# EAGLE design Bit Wah 2 (EAGLE 9.6.2)
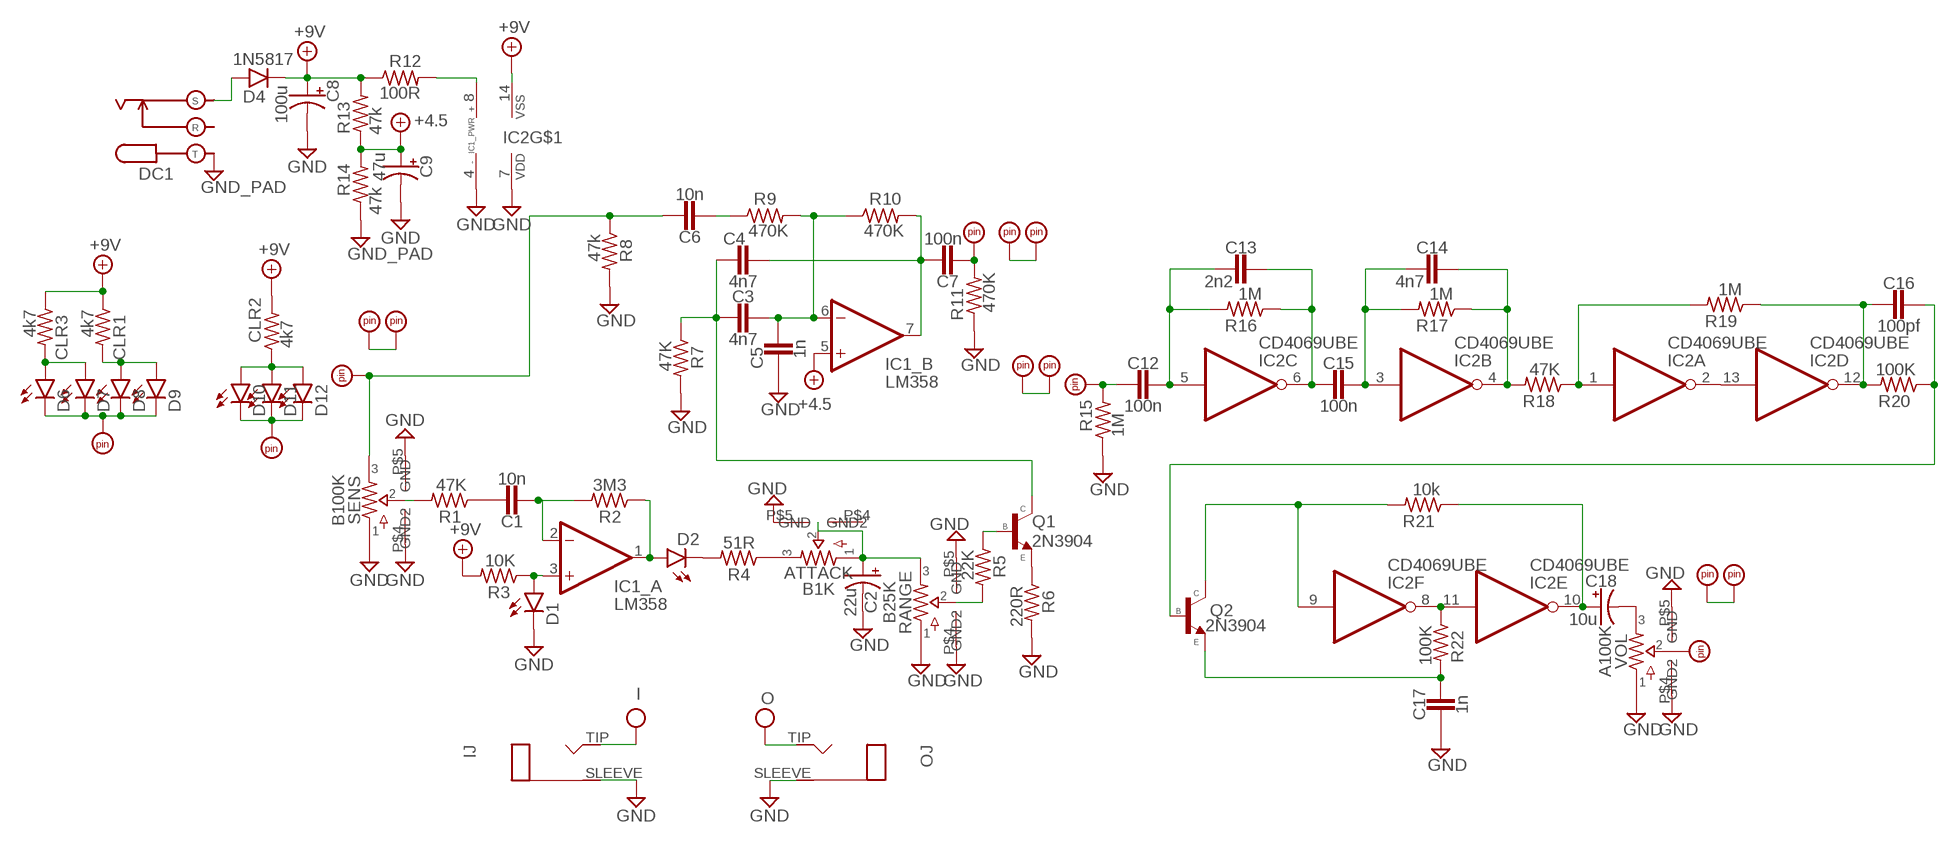
[diagram p0: schematic, sheet 1]

## Parts
1O  PADS.SQR_NL  [PAD4]
ATTACK  B1K  9MM.1  [9MM_METAL_SHAFT]
C1  10n  CAP  [0.2".SML.MED]
C2  22u  5MM.2  [0502]
C3  4n7  CAP  [0.2".SML.MED]
C4  4n7  CAP  [0.2".SML.MED]
C5  1n  CAP  [0.2".SML.MED]
C6  10n  CAP  [0.2".SML.MED]
C7  100n  CAP  [0.2".SML.MED]
C8  100u  6MM.2  [0632]
C9  47u  5MM.2  [0502]
C12  100n  CAP  [0.2".SML.MED]
C13  2n2  CAP  [0.2".SML.MED]
C14  4n7  CAP  [0.2".SML.MED]
C15  100n  CAP  [0.2".SML.MED]
C16  100pf  CAP.2  [0.2".SML]
C17  1n  CAP  [0.2".SML.MED]
C18  10u  5MM.2  [0502]
CLR1  4k7  RESISTORS.3B  [R0207/3]
CLR2  4k7  RESISTORS.3B  [R0207/3]
CLR3  4k7  RESISTORS.3B  [R0207/3]
D1  3MM RED  LED3MM  [LED3MM]
D2  3MM RED  LED3MM  [LED3MM]
D4  1N5817  DO41.3  [DO41-3]
D6  LED3MM  [LED3MM]
D7  LED3MM  [LED3MM]
D8  LED3MM  [LED3MM]
D9  LED3MM  [LED3MM]
D10  LED3MM  [LED3MM]
D11  LED3MM  [LED3MM]
D12  LED3MM  [LED3MM]
DC1  DC  DC_KOBICONN  [DC_KOBICONN]
GND2  GND_PAD  [SQUARE]
GND5  GND_PAD  [SQUARE]
I  IN  [SQUARE]
IC1  LM358  DUAL_TH  [DIP08]
IC2  CD4069UBE  [DIL14]
IJ  MONOPADS  [TWO_PADS]
O  OUT  [SQUARE]
OJ  MONOPADS  [TWO_PADS]
Q1  2N3904  NPN.2  [INLINE]
Q2  2N3904  NPN.2  [INLINE]
R1  47K  RESISTORS.3B  [R0207/3]
R2  3M3  RESISTORS.3B  [R0207/3]
R3  10K  RESISTORS.3B  [R0207/3]
R4  51R  RESISTORS.3B  [R0207/3]
R5  22K  RESISTORS.3B  [R0207/3]
R6  220R  RESISTORS.3B  [R0207/3]
R7  47K  RESISTORS.3B  [R0207/3]
R8  47k  RESISTORS.3B  [R0207/3]
R9  470K  RESISTORS.3B  [R0207/3]
R10  470K  RESISTORS.3B  [R0207/3]
R11  470K  RESISTORS.3B  [R0207/3]
R12  100R  RESISTORS.3B  [R0207/3]
R13  47k  RESISTORS.3B  [R0207/3]
R14  47k  RESISTORS.3B  [R0207/3]
R15  1M  RESISTORS.3B  [R0207/3]
R16  1M  RESISTORS.3B  [R0207/3]
R17  1M  RESISTORS.3B  [R0207/3]
R18  47K  RESISTORS.3B  [R0207/3]
R19  1M  RESISTORS.3B  [R0207/3]
R20  100K  RESISTORS.3B  [R0207/3]
R21  10k  RESISTORS.3B  [R0207/3]
R22  100K  RESISTORS.3B  [R0207/3]
RA  PADS.SQR_NL  [PAD4]
RANGE  B25K  9MM.1  [9MM_METAL_SHAFT]
RB  PADS.SQR_NL  [PAD4]
RB1  PADS.SQR_NL  [PAD4]
SA  PADS.SQR_NL  [PAD4]
SA1  PADS.SQR_NL  [PAD4]
SB  PADS.SQR_NL  [PAD4]
SB1  PADS.SQR_NL  [PAD4]
SENS  B100K  9MM.1  [9MM_METAL_SHAFT]
SW1  SW1  PADS.SQR_NL  [PAD4]
SW2  PADS.SQR_NL  [PAD4]
U$4  OUT1  PADS.SQR_NL  [PAD4]
U$5  PADS.SQR_NL  [PAD4]
U$6  PADS.SQR_NL  [PAD4]
U$7  PADS.SQR_NL  [PAD4]
VOL  A100K  9MM.1  [9MM_METAL_SHAFT]

## Nets
+9V: C8.+ CLR1.1 CLR2.2 CLR3.1 D4.C IC2.14(VSS) R3.2 R12.1 R13.2
GND: ATTACK.P$5(GND2) C2.- C5.2 C8.- C9.- C17.2 D1.K(C) DC1.T GND2.1(GND) GND5.1(GND) IC1.4(_PWR:V-) IC2.7(VDD) IJ.SLEEVE OJ.SLEEVE R6.2 R7.2 R8.2 R11.1 R14.1 R15.1 RANGE.P$1 RANGE.P$4(GND) RANGE.P$5(GND2) SENS.P$1 SENS.P$4(GND) SENS.P$5(GND2) VOL.P$1 VOL.P$4(GND) VOL.P$5(GND2)
IN: I.1(IN) IJ.TIP
N$1: C1.1 R1.1
N$2: 1O.P$1 RA.P$1
N$3: D1.A IC1.3(_A:+IN) R3.1
N$4: D4.A DC1.S
N$5: ATTACK.P$1 ATTACK.P$2 C2.+ RANGE.P$3
N$6: SA1.P$1 SA.P$1
N$7: R1.2 SENS.P$2
N$8: C1.2 IC1.2(_A:-IN) R2.2
N$9: D2.A IC1.1(_A:OUT) R2.1
N$10: D2.K(C) R4.2
N$11: ATTACK.P$3 R4.1
N$12: IC1.8(_PWR:V+) R12.2
N$13: Q1.1(E) R6.1
N$14: R5.2 RANGE.P$2
N$15: Q1.2(B) R5.1
N$16: C3.2 C4.2 Q1.3(C) R7.1
N$17: C3.1 C5.1 IC1.6(_B:-IN) R9.2 R10.1
N$18: C6.2 R9.1
N$19: C12.1 C13.2 IC2.5(C:I) R16.2
N$20: C4.1 C7.1 IC1.7(_B:OUT) R10.2
N$21: C13.1 C15.2 IC2.6(C:O) R16.1
N$22: C14.2 C15.1 IC2.3(B:I) R17.2
N$23: C14.1 IC2.4(B:O) R17.1 R18.2
N$24: IC2.1(A:I) R18.1 R19.2
N$25: IC2.2(A:O) IC2.13(D:I)
N$26: C16.2 IC2.12(D:O) R19.1 R20.2
N$27: C16.1 Q2.2(B) R20.1
N$28: IC2.8(F:O) IC2.11(E:I) R22.1
N$29: C17.1 Q2.1(E) R22.2
N$30: C18.+ IC2.10(E:O) R21.1
N$31: C18.- VOL.P$3
N$32: IC2.9(F:I) Q2.3(C) R21.2
N$33: D6.K(C) D7.K(C) D8.K(C) D9.K(C) SW1.P$1
N$34: D10.K(C) D11.K(C) D12.K(C) SW2.P$1
N$35: CLR1.2 D8.A D9.A
N$36: CLR2.1 D10.A D11.A D12.A
N$37: SB1.P$1 SB.P$1
N$38: RB1.P$1 RB.P$1
N$39: C7.2 R11.2 U$4.P$1
N$40: C6.1 R8.1 SENS.P$3 U$5.P$1
N$41: C12.2 R15.2 U$6.P$1
N$42: U$7.P$1 VOL.P$2
N$43: CLR3.2 D6.A D7.A
OUT: O.1(OUT) OJ.TIP
VA: C9.+ IC1.5(_B:+IN) R13.1 R14.2 ; supply symbol labelled +4.5
Unconnected: ATTACK.P$4(GND) DC1.R

## Library data of the parts
1O RA RB RB1 SA SA1 SB SB1 SW1 SW2 U$4-U$7 = supply pins:PADS.: Pads For I/O connections or test point pads on PCBs.
ATTACK RANGE SENS VOL = potentiometers:9MM: 9mm Potentiometers
C1 C3-C7 C12-C17 = caps-film:CAP: For Ceramic, Film, MLCC caps
C2 C9 C18 = caps-elec:5MM: 5mm diameter caps Up to 47uF
C8 = caps-elec:6MM: 6.3mm diameter caps 100uF - 270uF
CLR1-CLR3 R1-R22 = resistors:RESISTORS
D1 D2 D6-D12 = diodes:LED
D4 = diodes:DO41: 1N400x, 1N5817 Standard and Schottky Rectifiers, DO-41 Package 1N4001: http://smallbear-electronics.mybigcommerce.com/diode-1n4001/ 1N5817: http://www.mouser.com/ProductDetail/Fairchild-Semiconductor/1N5817/?qs=sGAEpiMZZMtQ8nqTKtFS%2fCJFZUIIOyzjWJhH2RQmKoY%3d
DC1 = jacks:DC_KOBICONN
GND2 GND5 = supply pins:GND_PAD: Ground use this to hook up ground connections throughout a schematic instead of running wire automatically labels the net "GND"
I = supply pins:IN: Input obsolete: use Mark instead and label net schematic input label without circuit board terminal/pad labels net "IN" provided as complement to OUT (rarely used)
IC1 = integrated circuits:DUAL: Generic Dual OP-AMP
IC2 = CD4069UBE Pin:CD4069UBE: Hex Inverting Buffer
IJ OJ = jacks:MONO: Mono 1/4" Phone Jack
O = supply pins:OUT: Output obsolete: use Mark instead and label net output label without circuit board terminal/pad commonly used as output label on 2nd lug of a potentiometer
Q1 Q2 = transistors-GERM:NPN: NPN Germanium (E)-B-C pinout TO-5 socket: http://smallbear-electronics.mybigcommerce.com/to-5-transistor-mill-max/

## Board
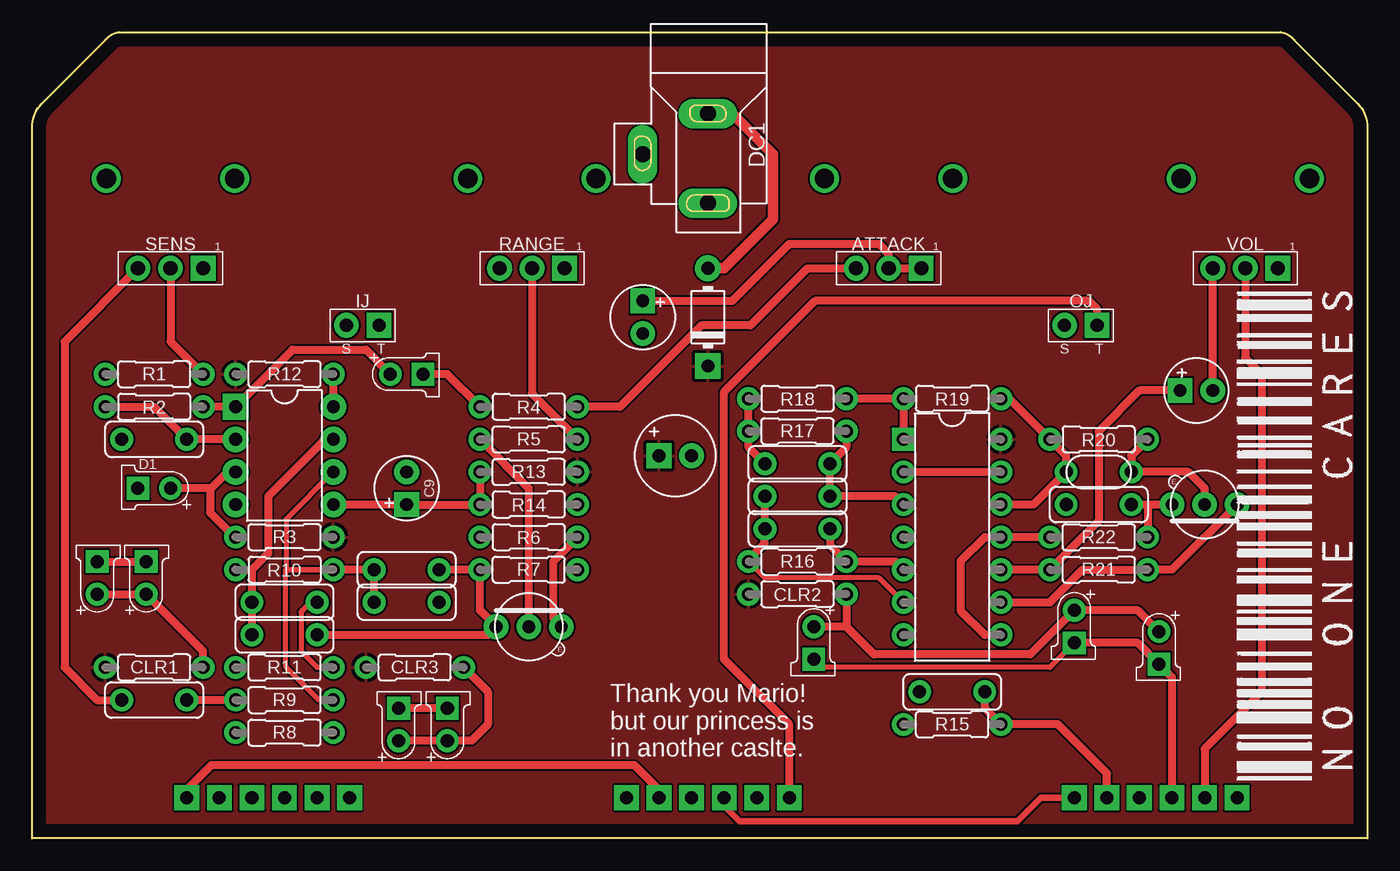
[diagram p1: board, top side]
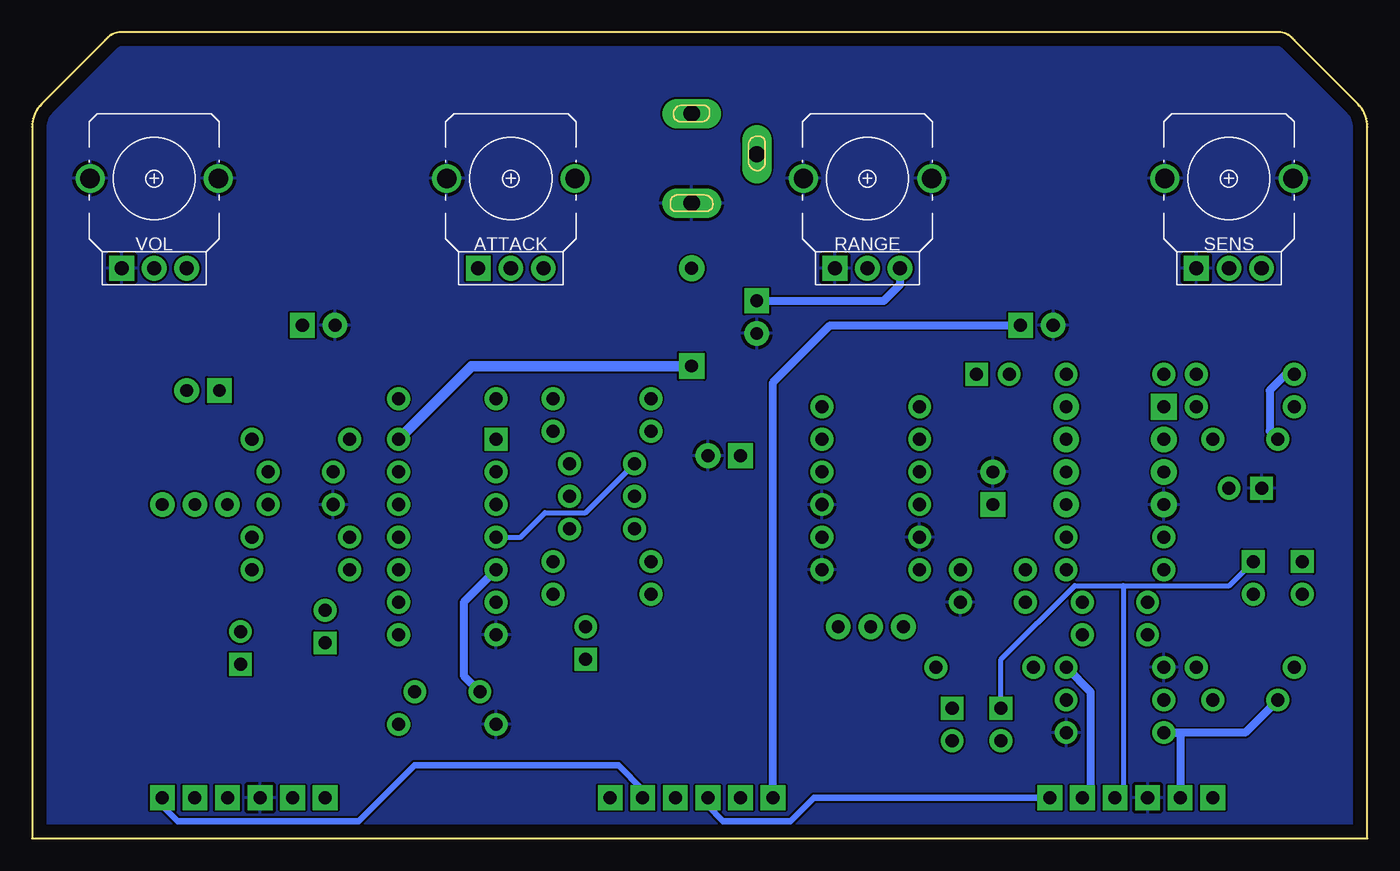
[diagram p2: board, bottom side, seen from below]

Size 104.14 x 62.87 mm. Coordinates in mm from the lower left corner, seen from the top.
Outline: 0,0 0,55.46 arc-45 0.74,57.26 5.61,62.12 arc-45 6.77,62.87 97.37,62.87 arc-45 98.53,62.12 103.4,57.26 arc-45 104.14,55.46 104.14,0 0,0
Copper layers (1*16): Top 0.035mm / dielectric 1.5mm / Bottom 0.035mm
Design rules "default": minimum track width 6mil, minimum drill 0.35mm, track to track 6mil, track to pad 6mil, pad to pad 6mil, via to via 6mil, smd to smd 6mil, copper to edge 40mil, drill to drill 6mil, minimum pad ring 10mil, minimum via ring 8mil, stop-mask expansion 4mil, vias tented up to drill 0mil, thermal gap 10mil

### Footprints (pad centres in the part's own frame; a part is rotated, then mirrored left to right if it is on the bottom)
PAD4 = drill 1.016 pad 1.93 square: P$1 0,0
9MM_METAL_SHAFT = drill 1.1 pad 1.93 square: P$1 2.54,0 | drill 1.1 pad 1.93: P$2 0,0; P$3 -2.54,0 | drill 1.5: P$4 -5,7; P$5 5,7
0.2".SML.MED = drill 1.016 pad 1.778: 1 -2.54,0; 2 2.54,0
0502 = drill 1 pad 1.93 square: + -1.27,0 | drill 1 pad 1.93: - 1.27,0
0632 = drill 1 pad 1.93 square: + -1.27,0 | drill 1 pad 1.93: - 1.27,0
0.2".SML = drill 1.016 pad 1.778: 1 -2.54,0; 2 2.54,0
R0207/3 = drill 1.016 pad 1.778: 1 -3.81,0; 2 3.81,0
LED3MM = drill 1.016 pad 1.778: A -1.27,0 | drill 1.016 pad 1.778 square: K 1.27,0
DO41-3 = drill 1 pad 2: A 3.81,0 | drill 1 pad 2 square: C -3.81,0
DC_KOBICONN = drill 1.27 pad 2.286 long: R 0,5.08; S 3.175,0; T -3.81,0
SQUARE = drill 1.016 pad 1.93 square: 1 0,0
DIP08 = drill 1 pad 2 square: 1 -3.81,-3.81 | drill 1 pad 2: 2 -1.27,-3.81; 3 1.27,-3.81; 4 3.81,-3.81; 5 3.81,3.81; 6 1.27,3.81; 7 -1.27,3.81; 8 -3.81,3.81
DIL14 = drill 1.016 pad 1.778 square: 1 -7.62,-3.81 | drill 1.016 pad 1.778: 2 -5.08,-3.81; 3 -2.54,-3.81; 4 0,-3.81; 5 2.54,-3.81; 6 5.08,-3.81; 7 7.62,-3.81; 8 7.62,3.81; 9 5.08,3.81; 10 2.54,3.81; 11 0,3.81; 12 -2.54,3.81; 13 -5.08,3.81; 14 -7.62,3.81
TWO_PADS = drill 1.016 pad 1.93: SLEEVE -1.27,0 | drill 1.016 pad 1.93 square: TIP 1.27,0
INLINE = drill 1 pad 1.93: 1 -2.54,0; 2 0,0; 3 2.54,0

### Placement (x,y rotation side)
1O  51.44,3.17 0 top
ATTACK  66.8,44.45 0 top
C1  9.53,31.11 0 top
C2  47.62,40.64 270 top
C3  29.21,20.95 0 top
C4  19.68,15.88 0 top
C5  29.21,18.41 0 top
C6  9.53,10.79 0 top
C7  19.68,18.41 0 top
C8  50.16,29.84 0 top
C9  29.21,27.3 90 top
C12  71.75,11.43 0 top
C13  59.69,24.13 0 top
C14  59.69,29.21 0 top
C15  59.69,26.67 180 top
C16  83.19,28.57 180 top
C17  83.19,26.04 180 top
C18  90.8,34.92 0 top
CLR1  9.53,13.34 0 top
CLR2  59.69,19.05 180 top
CLR3  29.84,13.34 0 top
D1  9.53,27.3 180 top
D2  29.21,36.2 0 top
D4  52.7,40.64 90 top
D6  32.38,8.89 90 top
D7  28.57,8.89 90 top
D8  8.89,20.32 90 top
D9  5.08,20.32 90 top
D10  60.96,15.24 270 top
D11  81.28,16.51 270 top
D12  87.88,14.86 270 top
DC1  52.7,53.34 90 top
GND2  86.36,3.17 0 top
GND5  17.14,3.17 0 top
I  46.35,3.17 0 top
IC1  19.68,29.84 270 top
IC2  71.75,23.5 270 top
IJ  25.78,40.01 0 top
O  59.05,3.17 0 top
OJ  81.79,40.01 0 top
Q1  38.73,16.51 180 top
Q2  91.44,26.04 0 top
R1  9.53,36.2 0 top
R2  9.53,33.66 180 top
R3  19.68,23.5 0 top
R4  38.73,33.66 180 top
R5  38.73,31.11 0 top
R6  38.73,23.5 180 top
R7  38.73,20.95 0 top
R8  19.68,8.26 0 top
R9  19.68,10.79 0 top
R10  19.68,20.95 180 top
R11  19.68,13.34 0 top
R12  19.68,36.2 0 top
R13  38.73,28.57 0 top
R14  38.73,26.04 180 top
R15  71.75,8.89 0 top
R16  59.69,21.59 0 top
R17  59.69,31.75 0 top
R18  59.69,34.29 180 top
R19  71.75,34.29 180 top
R20  83.19,31.11 180 top
R21  83.19,20.95 0 top
R22  83.19,23.5 0 top
RA  24.77,3.17 0 top
RANGE  38.99,44.45 0 top
RB  93.98,3.17 0 top
RB1  56.52,3.17 0 top
SA  12.07,3.17 0 top
SA1  48.89,3.17 0 top
SB  81.28,3.17 0 top
SB1  53.98,3.17 0 top
SENS  10.79,44.45 0 top
SW1  19.68,3.17 0 top
SW2  88.9,3.17 0 top
U$4  22.22,3.17 0 top
U$5  14.61,3.17 0 top
U$6  83.82,3.17 0 top
U$7  91.44,3.17 0 top
VOL  94.61,44.45 0 top

### Tracks (layer width: path | path; a pad name or v marks a point on that pad's centre or on a via)
+9V
  Bottom 0.813: D4.C 69.85,36.83 IC2.14
  pour Top: 0.11,0 0.11,56.62 5.61,62.12 arc-45 7.4,62.87 96.74,62.87 arc-45 98.53,62.12 103.4,57.26 arc-45 104.14,55.46 104.14,0
GND
  pour Bottom: 0.11,0 0.11,56.62 5.61,62.12 arc-45 7.4,62.87 96.74,62.87 arc-45 98.53,62.12 103.4,57.26 arc-45 104.14,55.46 104.14,0
IN
  Bottom 0.61: I.1 46.35,35.56 41.91,40.01 IJ.TIP
N$1
  Bottom 0.61: C1.1 7.62,31.75 7.62,34.92 6.35,36.2 R1.1
N$2
  Bottom 0.508: RA.P$1 43.18,3.17 45.01,1.35 50.24,1.35 51.44,2.54 1O.P$1
N$3
  Top 0.406: R3.1 15.79,23.5 | 13.97,27.3 13.88,27.22
  Top 0.61: 15.79,23.5 13.88,25.4 13.88,27.22 | IC1.3 15.24,28.57 13.97,27.3 D1.A
N$4
  Top 0.813: D4.A 53.98,44.45 57.78,48.26 57.78,53.34 54.61,56.52 DC1.S
N$5
  Top 0.61: C2.+ 54.61,41.91 59.05,46.35 66.04,46.35 66.8,45.59 ATTACK.P$2 ATTACK.P$1
  Bottom 0.61: RANGE.P$3 36.45,43.18 37.72,41.91 C2.+
N$6
  Top 0.61: SA1.P$1 48.89,3.81 46.99,5.71 13.97,5.71 12.07,3.81 SA.P$1
N$7
  Top 0.61: SENS.P$2 10.79,38.73 R1.2
N$8
  Top 0.61: IC1.2 C1.2 9.53,33.66 R2.2
N$9
  Top 0.61: R2.1 IC1.1 20.32,38.1 26.04,38.1 D2.A
N$10
  Top 0.61: R4.2 32.38,36.2 D2.K
N$11
  Top 0.61: R4.1 45.85,33.66 52.2,40.01 56.01,40.01 60.45,44.45 ATTACK.P$3
N$12
  Top 0.61: R12.2 IC1.8
N$13
  Top 0.61: Q1.1 40.64,17.14 40.64,21.59 R6.1
N$14
  Top 0.61: R5.2 38.99,34.67 RANGE.P$2
N$15
  Top 0.61: R5.1 38.73,27.3 Q1.2
N$16
  Top 0.61: C3.2 R7.1 34.92,17.78 Q1.3 35.56,15.88 C4.2
N$17
  Top 0.406: IC1.6 19.81,24.89 19.81,20.95 R10.1 19.79,20.95 19.79,13.38 22.37,10.79 R9.2
  Top 0.61: C5.1 C3.1 R10.1
N$18
  Top 0.61: R9.1 C6.2
N$19
  Top 0.61: C13.2 62.23,22.86 R16.2 67.31,21.59 IC2.5
  Bottom 0.61: IC2.5 70.48,18.41 70.48,12.7 C12.1
N$20
  Top 0.61: IC1.7 22.86,31.11 18.41,26.67 18.41,22.23 17.14,20.95 | R10.2 17.14,20.95 | 17.14,20.95 C7.1 C4.1
N$21
  Top 0.406: IC2.6 66.04,20.32 57.15,20.32 R16.1 55.88,21.73 | 57.12,24.11 C13.1
  Top 0.61: 55.88,21.73 57.12,22.98 57.12,24.11 | C13.1 C15.2
N$22
  Top 0.61: IC2.3 67.31,26.67 C15.1 C14.2 63.5,30.48 R17.2
N$23
  Top 0.61: C14.1 55.88,30.48 R17.1 R18.2
  Bottom 0.406: IC2.4 66.04,23.5 64.14,25.4 60.96,25.4 C14.1
N$24
  Top 0.61: R18.1 R19.2 IC2.1
N$25
  Top 0.61: IC2.2 IC2.13
N$26
  Top 0.61: R19.1 76.2,34.29 R20.2 80.64,29.84 C16.2 78.11,26.04 IC2.12
N$27
  Top 0.61: Q2.2 91.44,27.3 90.17,28.57 C16.1 85.72,29.84 R20.1
N$28
  Top 0.61: IC2.8 74.3,15.88 72.41,17.75 72.41,21.61 74.3,23.5 IC2.11 R22.1
N$29
  Top 0.406: C17.1 87,26.04
  Top 0.61: Q2.1 C17.1 | 87,26.04 R22.2
N$30
  Top 0.61: IC2.10 R21.1 83.19,24.77 83.19,31.75 86.36,34.92 C18.+
N$31
  Top 0.61: C18.- VOL.P$3
N$32
  Top 0.61: IC2.9 79.38,18.41 81.91,20.95 R21.2 88.9,20.95 Q2.3
N$33
  Top 0.61: D6.K D7.K | D9.K D8.K
  Bottom 0.406: 19.05,19.71 22.83,19.71 28.57,13.97 D7.K | 19.05,19.71 10.77,19.71 D8.K | 19.05,19.71 19.05,3.81 SW1.P$1
N$34
  Top 0.406: D11.K 79.38,13.34 61.59,13.34 D10.K
  Top 0.61: D11.K 86.23,15.24 D12.K 88.9,12.57 SW2.P$1
N$35
  Top 0.61: D9.A D8.A 13.34,14.61 CLR1.2
N$36
  Top 0.61: CLR2.1 63.5,16.51 | 63.5,16.51 D10.A | D12.A 86.23,17.78 D11.A 77.85,14.35 65.66,14.35 63.5,16.51
N$37
  Top 0.508: SB1.P$1 53.98,2.54 55.17,1.35 76.83,1.35 78.66,3.17 SB.P$1
N$38
  Bottom 0.508: RB.P$1 93.98,2.54 92.79,1.35 78.66,1.35 74.3,5.71 58.42,5.71 56.52,3.81 RB1.P$1
N$39
  Top 0.406: C7.2 21.73,18.41 20.98,17.66 20.98,14.58 22.22,13.34 R11.2
  Bottom 0.61: R11.2 21.59,11.43 21.59,3.81 U$4.P$1
N$40
  Top 0.61: SENS.P$3 2.54,38.73 2.54,13.34 5.08,10.79 C6.1
  Bottom 0.61: C6.1 9.53,8.26 R8.1 14.61,8.26 U$5.P$1
N$41
  Top 0.61: C12.2 74.3,10.16 R15.2 80.01,8.89 83.82,5.08 U$6.P$1
N$42
  Top 0.61: U$7.P$1 91.44,6.99 95.89,11.43 95.89,36.2 94.61,37.47 VOL.P$2
N$43
  Top 0.61: D7.A D6.A 34.29,7.62 35.56,8.89 35.56,11.43 CLR3.2
OUT
  Top 0.61: O.1 59.05,8.89 53.98,13.97 53.98,34.82 61.07,41.91 82.42,41.91 83.06,41.27 OJ.TIP
VA
  Top 0.61: IC1.5 C9.+ R14.2 R13.1

### Text on the board
tPlace: Thank you Mario! / but our princess is / in another caslte.
tValues: BIT WAH rev 1.3 | NOC PEDALS